# EAGLE board LAUNCHXL-TMS57004_RevB (EAGLE 6.1), part 1 of 2
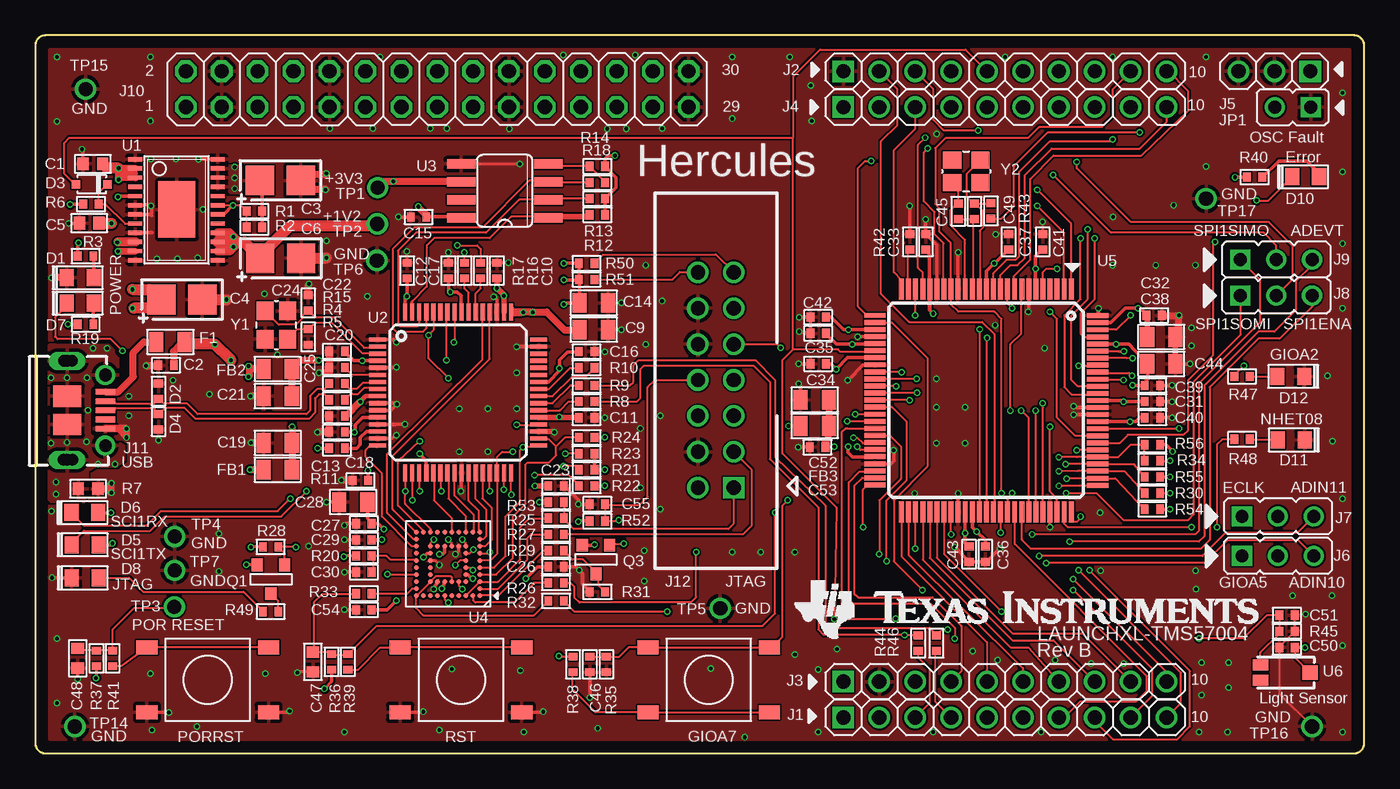
[diagram p6: board, top side]
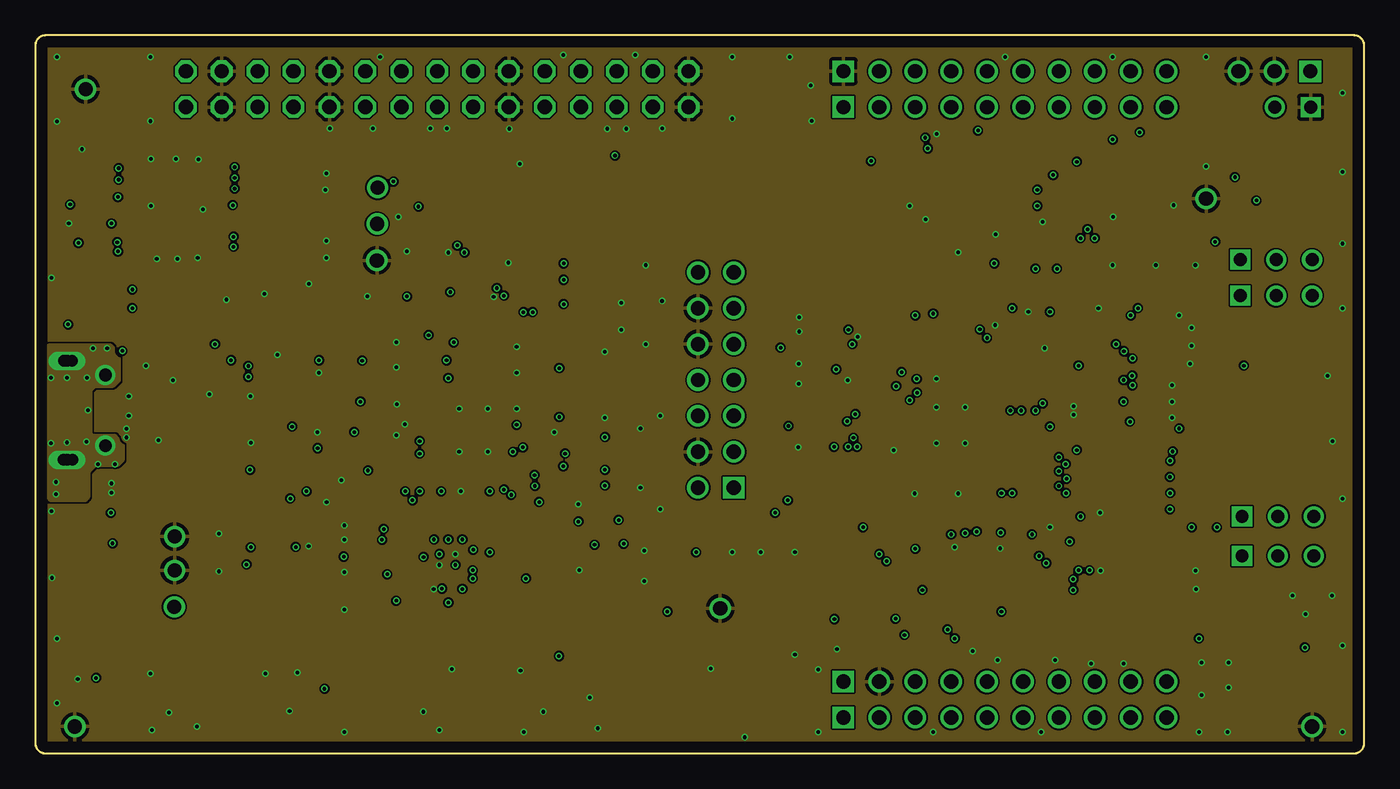
[diagram p7: board, inner layer Route2]
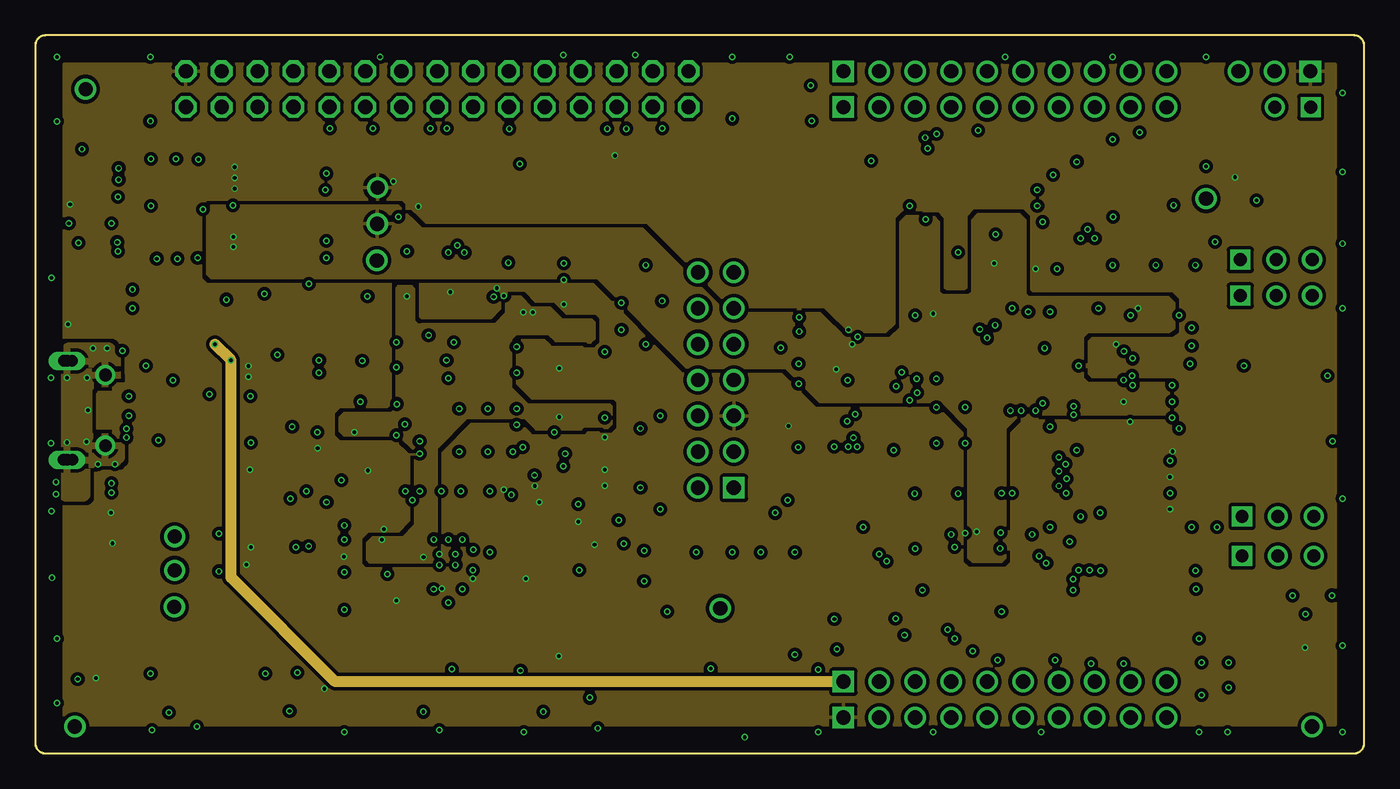
[diagram p8: board, inner layer Route3]
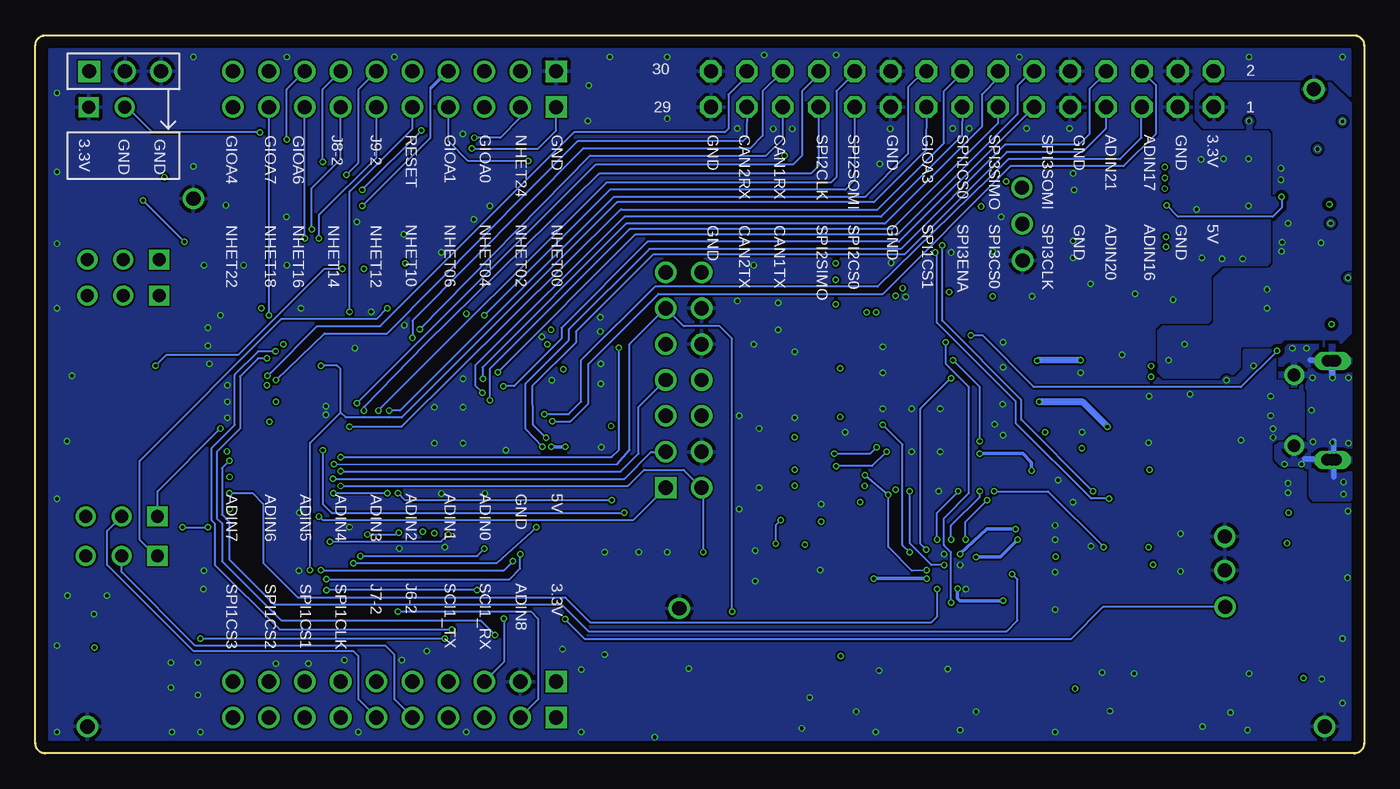
[diagram p9: board, bottom side, seen from below]

Size 93.98 x 50.8 mm. Coordinates in mm from the lower left corner, seen from the top.
Outline: 0.72,0 93.26,0 arc90 93.98,0.72 93.98,50.08 arc90 93.26,50.8 0.72,50.8 arc90 0,50.08 0,0.72 arc90 0.72,0
Copper layers (1*2+3*16): Top 0.035mm / dielectric 0.3mm / Route2 0.035mm / dielectric 0.8mm / Route3 0.035mm / dielectric 0.3mm / Bottom 0.035mm
Design rules: minimum track width 5mil, minimum drill 8mil, track to track 5mil, track to pad 5mil, pad to pad 6mil, via to via 5mil, smd to smd 3mil, copper to edge 30mil, drill to drill 8mil, minimum pad ring 10mil, minimum via ring 4mil, stop-mask expansion 3mil, vias tented up to drill 10mil, thermal gap 10mil

## Footprints (pad centres in the part's own frame; a part is rotated, then mirrored left to right if it is on the bottom)
0603 = smd 0.8 x 0.9: 1 -0.7,-0.05; 2 0.7,-0.05
0402 = smd 0.55 x 0.65: 1 -0.55,0; 2 0.55,0
CT3528 = smd 2 x 2.1: + -1.5,0; - 1.4,0
0805 = smd 1 x 1.4: 1 -1,0; 2 1,0
LED0805 = smd 1 x 1.2: A 1.052,0.102; C -0.848,0.102
SOD-323 = smd 0.6 x 0.6: A 1.125,0.051; C -1.075,0.051
PINHEAFER1X10 = drill 1.016 square: 1 -11.43,0 | drill 1.016: 2 -8.89,0; 3 -6.35,0; 4 -3.81,0; 5 -1.27,0; 6 1.27,0; 7 3.81,0; 8 6.35,0; 9 8.89,0; 10 11.43,0
PINHEADER1X3 = drill 1.016 square: 1 -2.54,0 | drill 1.016: 2 0,0; 3 2.54,0
HEADER3-100 = drill 0.914 square: 1 -2.54,0 | drill 0.914: 2 0,0; 3 2.54,0
2X15 = drill 1.016 octagon: 1 -17.78,-1.27; 2 -17.78,1.27; 3 -15.24,-1.27; 4 -15.24,1.27; 5 -12.7,-1.27; 6 -12.7,1.27; 7 -10.16,-1.27; 8 -10.16,1.27; 9 -7.62,-1.27; 10 -7.62,1.27; 11 -5.08,-1.27; 12 -5.08,1.27; 13 -2.54,-1.27; 14 -2.54,1.27; 15 0,-1.27; 16 0,1.27; 17 2.54,-1.27; 18 2.54,1.27; 19 5.08,-1.27; 20 5.08,1.27; 21 7.62,-1.27; 22 7.62,1.27; 23 10.16,-1.27; 24 10.16,1.27; 25 12.7,-1.27; 26 12.7,1.27; 27 15.24,-1.27; 28 15.24,1.27; 29 17.78,-1.27; 30 17.78,1.27
MICRO_USB = smd 1.4 x 0.4: 1 0,2.6; 2 0,1.95; 3 0,1.3; 4 0,0.65; 5 0,0 | drill 0.8 long: 6 -2.7,-2.2; 9 -2.7,4.8 | drill 0.9: 7 0,-1.2; 8 0,3.8 | smd 2 x 1.5: 10 -2.7,2.3; 11 -2.7,0.3
BOXCONNECT2X7 = drill 1.016 square: 1 0,0 | drill 1.016: 2 0,2.54; 3 2.54,0; 4 2.54,2.54; 5 5.08,0; 6 5.08,2.54; 7 7.62,0; 8 7.62,2.54; 9 10.16,0; 10 10.16,2.54; 11 12.7,0; 12 12.7,2.54; 13 15.24,0; 14 15.24,2.54
JUMPER-2.54 = drill 0.914 square: 1 0,-1.27 | drill 0.914: 2 0,1.27
SOT-23 = smd 0.787 x 0.889: 1 0.025,-1.016; 2 -0.94,1.016; 3 0.991,1.016
T062S = smd 1.5 x 1: 1 -4.3,2.3; 2 4.3,2.3; 3 -4.3,-2.3; 4 4.3,-2.3
TP = drill 1 pad 1.5: 1 0,0
TSSOP24 = smd 0.305 x 0.991: 1 -3.753,-2.74; 2 -3.103,-2.74; 3 -2.453,-2.74; 4 -1.803,-2.74; 5 -1.153,-2.74; 6 -0.503,-2.74; 7 0.147,-2.74; 8 0.797,-2.74; 9 1.447,-2.74; 10 2.097,-2.74; 11 2.747,-2.74; 12 3.397,-2.74; 13 3.397,3.096; 14 2.747,3.096; 15 2.097,3.096; 16 1.447,3.096; 17 0.797,3.096; 18 0.147,3.096; 19 -0.503,3.096; 20 -1.153,3.096; 21 -1.803,3.096; 22 -2.453,3.096; 23 -3.103,3.096; 24 -3.753,3.096 | smd 4 x 2.6: 25 -0.2,0.2
LQFP64 = smd 1.2 x 0.3: 1 -1.331,8.449; 2 -1.331,7.949; 3 -1.331,7.449; 4 -1.331,6.949; 5 -1.331,6.449; 6 -1.331,5.949; 7 -1.331,5.449; 8 -1.331,4.949; 9 -1.331,4.449; 10 -1.331,3.949; 11 -1.331,3.449; 12 -1.331,2.949; 13 -1.331,2.449; 14 -1.331,1.949; 15 -1.331,1.449; 16 -1.331,0.949; 33 10.069,0.949; 34 10.069,1.449; 35 10.069,1.949; 36 10.069,2.449; 37 10.069,2.949; 38 10.069,3.449; 39 10.069,3.949; 40 10.069,4.449; 41 10.069,4.949; 42 10.069,5.449; 43 10.069,5.949; 44 10.069,6.449; 45 10.069,6.949; 46 10.069,7.449; 47 10.069,7.949; 48 10.069,8.449 | smd 0.3 x 1.2: 17 0.619,-1.001; 18 1.119,-1.001; 19 1.619,-1.001; 20 2.119,-1.001; 21 2.619,-1.001; 22 3.119,-1.001; 23 3.619,-1.001; 24 4.119,-1.001; 25 4.619,-1.001; 26 5.119,-1.001; 27 5.619,-1.001; 28 6.119,-1.001; 29 6.619,-1.001; 30 7.119,-1.001; 31 7.619,-1.001; 32 8.119,-1.001; 49 8.119,10.399; 50 7.619,10.399; 51 7.119,10.399; 52 6.619,10.399; 53 6.119,10.399; 54 5.619,10.399; 55 5.119,10.399; 56 4.619,10.399; 57 4.119,10.399; 58 3.619,10.399; 59 3.119,10.399; 60 2.619,10.399; 61 2.119,10.399; 62 1.619,10.399; 63 1.119,10.399; 64 0.619,10.399
SO8 = smd 0.66 x 2.032: 1 0.635,-5.613; 2 1.905,-5.613; 3 3.175,-5.613; 4 4.445,-5.613; 5 4.445,0.533; 6 3.175,0.533; 7 1.905,0.533; 8 0.635,0.533
CP56 = smd 0.35 x 0.35: A1 0,0; A2 0.5,0; A3 1,0; A4 1.5,0; A5 2,0; A6 2.5,0; A7 3,0; A8 3.5,0; A9 4,0; A10 4.5,0; B1 0,-0.5; B10 4.5,-0.5; C1 0,-1; C3 1,-1; C4 1.5,-1; C5 2,-1; C6 2.5,-1; C7 3,-1; C8 3.5,-1; C10 4.5,-1; D1 0,-1.5; D3 1,-1.5; D8 3.5,-1.5; D10 4.5,-1.5; E1 0,-2; E3 1,-2; E8 3.5,-2; E10 4.5,-2; F1 0,-2.5; F3 1,-2.5; F8 3.5,-2.5; F10 4.5,-2.5; G1 0,-3; G3 1,-3; G8 3.5,-3; G10 4.5,-3; H1 0,-3.5; H3 1,-3.5; H4 1.5,-3.5; H5 2,-3.5; H6 2.5,-3.5; H7 3,-3.5; H8 3.5,-3.5; H10 4.5,-3.5; J1 0,-4; J10 4.5,-4; K1 0,-4.5; K2 0.5,-4.5; K3 1,-4.5; K4 1.5,-4.5; K5 2,-4.5; K6 2.5,-4.5; K7 3,-4.5; K8 3.5,-4.5; K9 4,-4.5; K10 4.5,-4.5
LQFP100 = smd 1.5 x 0.35: 1 -7.875,6; 2 -7.875,5.5; 3 -7.875,5; 4 -7.875,4.5; 5 -7.875,4; 6 -7.875,3.5; 7 -7.875,3; 8 -7.875,2.5; 9 -7.875,2; 10 -7.875,1.5; 11 -7.875,1; 12 -7.875,0.5; 13 -7.875,0; 14 -7.875,-0.5; 15 -7.875,-1; 16 -7.875,-1.5; 17 -7.875,-2; 18 -7.875,-2.5; 19 -7.875,-3; 20 -7.875,-3.5; 21 -7.875,-4; 22 -7.875,-4.5; 23 -7.875,-5; 24 -7.875,-5.5; 25 -7.875,-6; 51 7.875,-6; 52 7.875,-5.5; 53 7.875,-5; 54 7.875,-4.5; 55 7.875,-4; 56 7.875,-3.5; 57 7.875,-3; 58 7.875,-2.5; 59 7.875,-2; 60 7.875,-1.5; 61 7.875,-1; 62 7.875,-0.5; 63 7.875,0; 64 7.875,0.5; 65 7.875,1; 66 7.875,1.5; 67 7.875,2; 68 7.875,2.5; 69 7.875,3; 70 7.875,3.5; 71 7.875,4; 72 7.875,4.5; 73 7.875,5; 74 7.875,5.5; 75 7.875,6 | smd 0.35 x 1.5: 26 -6.025,-7.875; 27 -5.525,-7.875; 28 -5.025,-7.875; 29 -4.525,-7.875; 30 -4.025,-7.875; 31 -3.525,-7.875; 32 -3.025,-7.875; 33 -2.525,-7.875; 34 -2.025,-7.875; 35 -1.525,-7.875; 36 -1.025,-7.875; 37 -0.525,-7.875; 38 -0.025,-7.875; 39 0.475,-7.875; 40 0.975,-7.875; 41 1.475,-7.875; 42 1.975,-7.875; 43 2.475,-7.875; 44 2.975,-7.875; 45 3.475,-7.875; 46 3.975,-7.875; 47 4.475,-7.875; 48 4.975,-7.875; 49 5.475,-7.875; 50 5.975,-7.875; 76 6,7.875; 77 5.5,7.875; 78 5,7.875; 79 4.5,7.875; 80 4,7.875; 81 3.5,7.875; 82 3,7.875; 83 2.5,7.875; 84 2,7.875; 85 1.5,7.875; 86 1,7.875; 87 0.5,7.875; 88 0,7.875; 89 -0.5,7.875; 90 -1,7.875; 91 -1.5,7.875; 92 -2,7.875; 93 -2.5,7.875; 94 -3,7.875; 95 -3.5,7.875; 96 -4,7.875; 97 -4.5,7.875; 98 -5,7.875; 99 -5.5,7.875; 100 -6,7.875
TEMT6000 = smd 1.1 x 0.8: 1 -3.5,0.55; 2 -3.5,-0.55 | smd 1.1 x 1: 3 0,0
CRYSTAL_3225 = smd 1.3 x 1.2: P$1 -1,-0.8; P$2 1,-0.8; P$3 1,0.8; P$4 -1,0.8

## Placement (x,y rotation side)
C1  1uF  [0603]  4.06,41.66 180 top
C2  100nF  [0402]  9.25,27.46 180 top
C3  22uF  [CT3528]  17.37,40.54 0 top
C4  22uF  [CT3528]  10.41,32.11 0 top
C5  1uF  [0603]  3.81,37.47 180 top
C6  47uF  [CT3528]  17.4,35.03 0 top
C9  4.7uF  [0805]  39.5,29.97 0 top
C10  100nF  [0402]  32.64,34.16 90 top
C11  100nF  [0402]  38.99,23.75 0 top
C12  100nF  [0402]  26.29,34.16 90 top
C13  100nF  [0402]  21.34,22.73 180 top
C14  4.7uF  [0805]  39.5,31.88 0 top
C15  100nF  [0402]  27.1,37.95 180 top
C16  100nF  [0402]  38.99,28.42 0 top
C17  100nF  [0402]  29.21,34.16 90 top
C18  100nF  [0402]  22.99,19.3 180 top
C19  4.7uF  [0805]  17.14,21.97 180 top
C20  100nF  [0402]  21.34,23.88 180 top
C21  4.7uF  [0805]  17.14,25.27 180 top
C22  100nF  [0402]  21.34,28.45 180 top
C23  100nF  [0402]  36.83,18.92 0 top
C24  22pF  [0402]  19.3,31.88 90 top
C25  22pF  [0402]  19.3,29.46 270 top
C26  100nF  [0402]  36.83,13.21 0 top
C27  100nF  [0402]  23.24,16.26 180 top
C28  4.7uF  [0805]  22.48,17.78 180 top
C29  100nF  [0402]  23.24,15.11 180 top
C30  100nF  [0402]  23.24,12.83 180 top
C31  100nF  [0402]  78.99,24.89 0 top
C32  100nF  [0402]  79.12,30.99 0 top
C33  100nF  [0402]  62.99,36.2 90 top
C34  100nF  [0402]  55.37,29.72 180 top
C35  100nF  [0402]  55.37,27.56 180 top
C36  100nF  [0402]  67.18,14.1 270 top
C37  100nF  [0402]  68.83,36.2 90 top
C38  4.7uF  [0805]  79.63,29.46 0 top
C39  100nF  [0402]  78.99,26.04 0 top
C40  100nF  [0402]  78.99,23.75 0 top
C41  100nF  [0402]  71.25,36.2 90 top
C42  100nF  [0402]  55.37,30.86 180 top
C43  100nF  [0402]  66.04,14.1 270 top
C44  4.7uF  [0805]  79.63,27.56 0 top
C45  22pF  [0402]  65.28,38.35 270 top
C46  100nF  [0402]  39.22,6.3 270 top
C47  1uF  [0603]  19.68,6.48 270 top
C48  1uF  [0603]  3.05,6.73 270 top
C49  22pF  [0402]  66.42,38.35 90 top
C50  100nF  [0402]  88.52,7.49 180 top
C51  100pF  [0402]  88.52,9.78 0 top
C52  4.7uF  [0805]  55.12,25.02 180 top
C53  100nF  [0402]  55.32,21.67 180 top
C54  100nF  [0402]  23.24,10.16 180 top
C55  100nF  [0402]  39.75,17.63 180 top
D1  White  [LED0805]  3.07,33.55 0 top
D2  TVS  [0402]  8.71,25.63 270 top
D3  NSR0320MW2T1G  [SOD-323]  4.01,40.31 180 top
D4  TVS  [0402]  8.71,23.47 270 top
D5  Blue  [LED0805]  3.43,14.66 0 top
D6  Blue  [LED0805]  3.4,16.94 0 top
D7  Blue  [LED0805]  3.07,31.75 0 top
D8  Blue  [LED0805]  3.43,12.32 0 top
D10  Red  [LED0805]  89.74,40.69 0 top
D11  White  [LED0805]  88.93,22.28 180 top
D12  White  [LED0805]  88.9,26.77 180 top
F1  FUSE  [0805]  9.55,29.11 0 top
FB1  220R @ 100M  [0805]  17.14,20.07 0 top
FB2  220R @ 100M  [0805]  17.14,27.2 0 top
FB3  220R @ 100M  [0805]  55.12,23.16 0 top
J1  [PINHEAFER1X10]  68.58,2.54 0 top
J2  [PINHEAFER1X10]  68.58,48.26 0 top
J3  [PINHEAFER1X10]  68.58,5.08 0 top
J4  [PINHEAFER1X10]  68.58,45.72 0 top
J5  [PINHEADER1X3]  87.63,48.26 180 top
J6  [HEADER3-100]  87.88,13.97 0 top
J7  [HEADER3-100]  87.88,16.76 0 top
J8  [HEADER3-100]  87.76,32.38 0 top
J9  [HEADER3-100]  87.76,34.92 0 top
J10  [2X15]  28.42,46.99 0 top
J11  105017-0001  [MICRO_USB]  4.95,22.97 0 top
J12  TI JTAG  [BOXCONNECT2X7]  49.4,18.8 90 top
JP1  [JUMPER-2.54]  88.93,45.72 90 top
Q1  FDV302P  [SOT-23]  16.64,12.32 0 top
Q3  FDV302P  [SOT-23]  39.62,13.72 0 top
R1  250K  [0402]  15.49,38.35 0 top
R2  250K  [0402]  15.49,37.21 0 top
R3  4.99K  [0402]  3.56,35.18 180 top
R4  22R  [0402]  21.34,26.16 180 top
R5  22R  [0402]  21.34,25.02 180 top
R6  100K  [0402]  3.94,38.86 180 top
R7  0R  [0603]  3.73,18.77 0 top
R8  0R  [0402]  38.99,24.89 0 top
R9  0R  [0402]  38.99,26.04 0 top
R10  0R  [0402]  38.99,27.28 0 top
R11  4.7K  [0402]  21.34,21.59 0 top
R12  4.7K  [0402]  39.75,38.1 0 top
R13  4.7K  [0402]  39.75,39.24 0 top
R14  4.7K  [0402]  39.75,41.53 0 top
R15  12K  [0402]  21.34,27.3 0 top
R16  200R  [0402]  31.5,34.16 90 top
R17  200R  [0402]  30.35,34.16 90 top
R18  2.2K  [0402]  39.75,40.39 180 top
R19  200R  [0402]  3.56,30.35 0 top
R20  10K  [0402]  23.24,13.97 180 top
R21  1K  [0402]  38.99,20.07 180 top
R22  1K  [0402]  38.99,18.92 180 top
R23  1K  [0402]  38.99,21.21 180 top
R24  1K  [0402]  38.99,22.35 180 top
R25  0R  [0402]  36.83,16.64 180 top
R26  0R  [0402]  36.83,12.06 180 top
R27  0R  [0402]  36.83,15.49 180 top
R28  100K  [0402]  16.64,14.61 180 top
R29  0R  [0402]  36.83,14.35 180 top
R30  0R  [0402]  78.99,18.41 0 top
R31  10K  [0402]  39.75,11.43 0 top
R32  0R  [0402]  36.83,10.79 180 top
R33  0R  [0402]  23.24,11.3 0 top
R34  0R  [0402]  78.99,20.7 180 top
R35  10K  [0402]  40.39,6.3 90 top
R36  10K  [0402]  20.95,6.48 270 top
R37  2.2K  [0402]  4.32,6.73 270 top
R38  1K  [0402]  38.02,6.3 270 top
R39  100R  [0402]  22.1,6.48 270 top
R40  1K  [0402]  86.23,40.77 180 top
R41  100R  [0402]  5.46,6.73 270 top
R42  0R  [0402]  61.85,36.2 90 top
R43  1K  [0402]  67.59,38.38 270 top
R44  0R  [0402]  62.43,7.8 90 top
R45  4.99K  [0402]  88.52,8.64 180 top
R46  0R  [0402]  63.73,7.8 90 top
R47  2.2K  [0402]  85.34,26.67 180 top
R48  2.2K  [0402]  85.34,22.23 180 top
R49  120R  [0402]  16.64,10.03 0 top
R50  10K  [0402]  38.99,34.67 180 top
R51  10K  [0402]  38.99,33.53 180 top
R52  10K  [0402]  39.75,16.43 180 top
R53  DNP  [0402]  36.83,17.78 180 top
R54  DNP  [0402]  78.99,17.27 0 top
R55  DNP  [0402]  78.99,19.56 0 top
R56  DNP  [0402]  78.99,21.84 0 top
S1  USER  [T062S]  47.62,5.21 180 top
S2  T062S  [T062S]  30.1,5.21 180 top
S3  T062S  [T062S]  12.19,5.21 180 top
TP1  TP  [TP]  24.21,40.03 0 top
TP2  TP  [TP]  24.18,37.47 0 top
TP3  TP  [TP]  9.83,10.36 0 top
TP4  TP  [TP]  9.86,15.34 0 top
TP5  TP  [TP]  48.44,10.26 0 top
TP6  TP  [TP]  24.16,34.87 0 top
TP7  TP  [TP]  9.86,12.95 0 top
TP14  TP  [TP]  2.79,1.91 0 top
TP15  TP  [TP]  3.56,46.99 0 top
TP16  TP  [TP]  90.3,1.91 0 top
TP17  TP  [TP]  82.8,39.24 0 top
U1  TPS70445PWP  [TSSOP24]  9.8,38.28 270 top
U2  FT2232HL  [LQFP64]  25.53,20.83 0 top
U3  93LC56C-I/SN  [SO8]  30.66,37.26 90 top
U4  XC2C32A-6CP56C  [CP56]  31.45,11.15 180 top
U5  RM42\\TMS570LS  [LQFP100]  67.26,24.97 270 top
U6  TEMT6000  [TEMT6000]  90.14,5.71 0 top
U$1  [TI_HORZ]  53.59,7.37 0 top
Y1  12M  [CRYSTAL_3225]  17.04,30.3 90 top
Y2  16M  [CRYSTAL_3225]  65.84,41.17 0 top